# Altium project BaseNode.PrjPCB
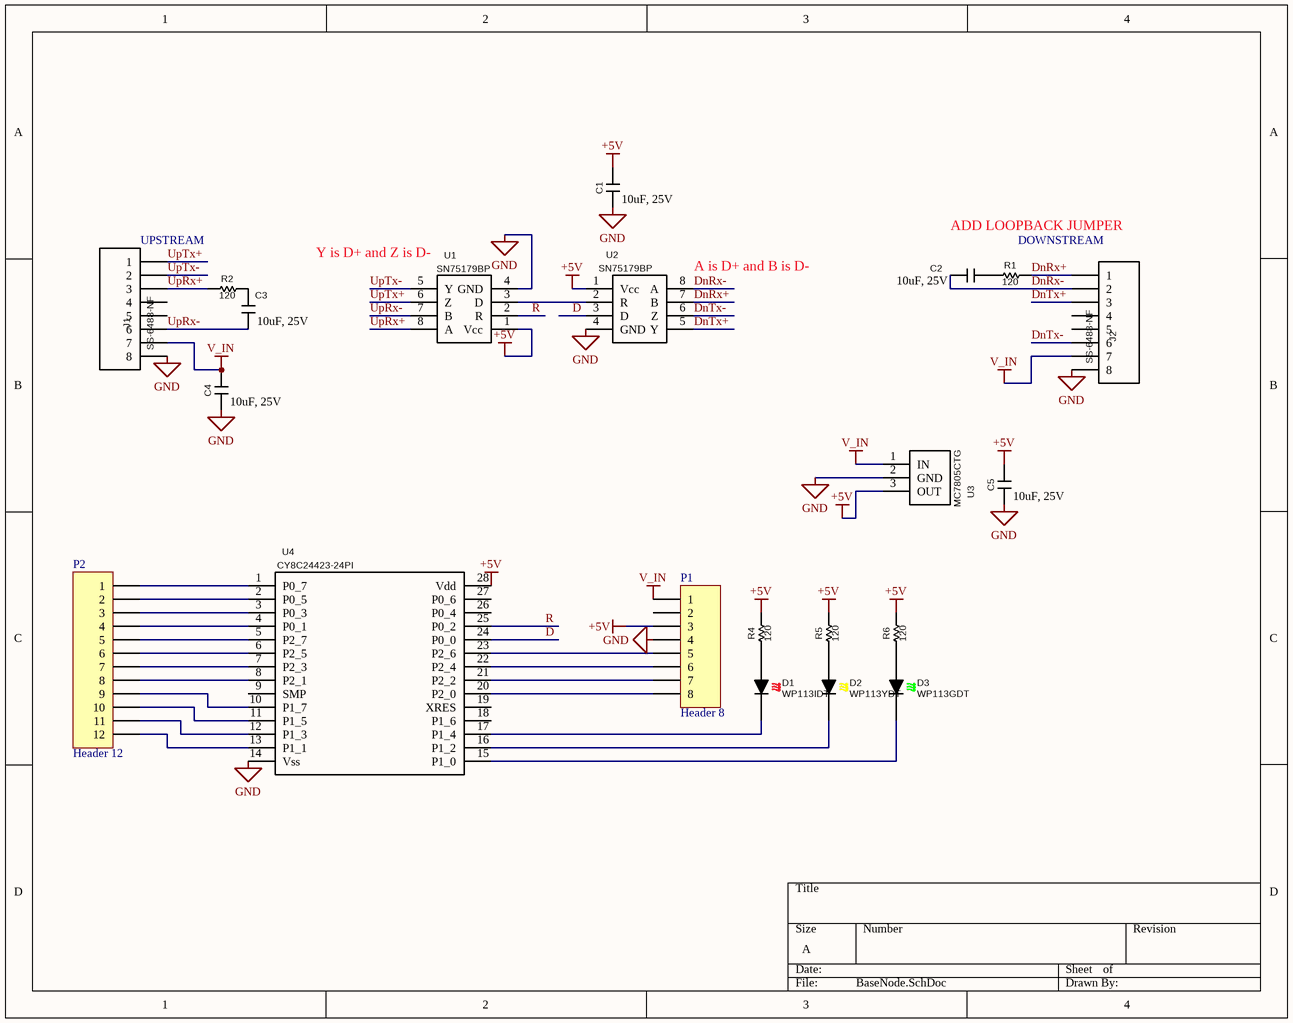
[diagram p0: BaseNode.SchDoc]
1 sheet, 21 parts. Net scope: global (net labels, ports and power ports of the same name join across sheets).
Board file: BaseNode.PcbDoc

## Sheet BaseNode.SchDoc
size A

### Parts
C1  10uF, 25V  [Capacitor TH 0.2]
C2  10uF, 25V  [Capacitor TH 0.2]
C3  10uF, 25V  [Capacitor TH 0.2]
C4  10uF, 25V  [Capacitor TH 0.2]
C5  10uF, 25V  [Capacitor TH 0.2]
D1  WP113IDT  [LED 100mil]
D2  WP113YDT  [LED 100mil]
D3  WP113GDT  [LED 100mil]
J1  SS-6488-NF  [SS-6488-NF]
J2  SS-6488-NF  [SS-6488-NF]
P1  Header 8  [HDR1X8]
P2  Header 12  [HDR1X12]
R1  120  [Resistor Axial 100mil]
R2  120  [Resistor Axial 100mil]
R4  120  [Resistor Axial 100mil]
R5  120  [Resistor Axial 100mil]
R6  120  [Resistor Axial 100mil]
U1  SN75179BP  [dip8]
U2  SN75179BP  [dip8]
U3  MC7805CTG  [TO-220]
U4  CY8C24423-24PI  [dip28]

### Nets
+5V: C1.2 C5.2 P1.3 R4.2 R5.2 R6.2 U1.1(Vcc) U2.1(Vcc) U3.3(OUT) U4.28(Vdd)
GND: C1.1 C4.1 C5.1 J1.8 J2.8 P1.4 U1.4(GND) U2.4(GND) U3.2(GND) U4.14(Vss)
V_IN: C4.2 J1.7 J2.7 P1.1 U3.1(IN)
D: U2.3(D) U4.24(P0_0)
DnRx+: J2.1 R1.2 U2.7(B)
DnRx-: C2.2 J2.2 U2.8(A)
DnTx+: J2.3 U2.5(Y)
DnTx-: J2.6 U2.6(Z)
R: U1.2(R) U4.25(P0_2)
UpRx+: J1.3 R2.1 U1.8(A)
UpRx-: C3.1 J1.6 U1.7(B)
UpTx+: J1.1 U1.6(Z)
UpTx-: J1.2 U1.5(Y)
NetC2_1: C2.1 R1.1
NetC3_2: C3.2 R2.2
NetD1_A: D1.A R4.1
NetD1_K: D1.K U4.17(P1_4)
NetD2_A: D2.A R5.1
NetD2_K: D2.K U4.16(P1_2)
NetD3_A: D3.A R6.1
NetD3_K: D3.K U4.15(P1_0)
NetP1_5: P1.5 U4.23(P2_6)
NetP1_6: P1.6 U4.22(P2_4)
NetP1_7: P1.7 U4.21(P2_2)
NetP1_8: P1.8 U4.20(P2_0)
NetP2_1: P2.1 U4.1(P0_7)
NetP2_2: P2.2 U4.2(P0_5)
NetP2_3: P2.3 U4.3(P0_3)
NetP2_4: P2.4 U4.4(P0_1)
NetP2_5: P2.5 U4.5(P2_7)
NetP2_6: P2.6 U4.6(P2_5)
NetP2_7: P2.7 U4.7(P2_3)
NetP2_8: P2.8 U4.8(P2_1)
NetP2_9: P2.9 U4.10(P1_7)
NetP2_10: P2.10 U4.11(P1_5)
NetP2_11: P2.11 U4.12(P1_3)
NetP2_12: P2.12 U4.13(P1_1)
NetU1_3: U1.3(D) U2.2(R)

Not connected (* = marked no-connect by the designer): J1 4 5; J2 4 5; P1 2; U4 9(SMP) 18(P1_6) 19(XRES) 26(P0_4) 27(P0_6)

### Notes on the sheet
- ADD LOOPBACK JUMPER
- (near J1) UPSTREAM
- (near U1) Y is D+ and Z is D-
- (near U2) A is D+ and B is D-
- DOWNSTREAM

### Library data of the parts
C1-C5 = Capacitor: Manufacturer: TDK Corporation; ManufacturerPN: FK20Y5V1E106Z; Vendor: Digi-Key; VendorPN: 445-2892-ND; ComponentLink1Description: Datasheet; ComponentLink1URL: http://www.tdk.co.jp/tefe02/e4941_fk.pdf; Value: 10uF, 25V
D1 = WP113IDT: LED RECT 2X5MM 625NM RED DIFF; Manufacturer: Kingbright Corp; Vendor: Digi-Key; VendorPN: 754-1201-ND; ComponentLink1URL: http://www.us.kingbright.com/images/catalog/SPEC/WP113GDT.pdf; ComponentLink1Description: Datasheet; ManufacturerPN: WP113IDT
D2 = WP113YDT: LED RECT 2X5MM 588NM YLW DIFF; Manufacturer: Kingbright Corp; Vendor: Digi-Key; VendorPN: 754-1203-ND; ComponentLink1URL: http://www.us.kingbright.com/images/catalog/SPEC/WP113YDT.pdf; ComponentLink1Description: Datasheet; ManufacturerPN: WP113YDT
D3 = WP113GDT: LED RECT 2X5MM 568NM GRN DIFF; Manufacturer: Kingbright Corp; Vendor: Digi-Key; VendorPN: 754-1200-ND; ComponentLink1URL: http://www.us.kingbright.com/images/catalog/SPEC/WP113GDT.pdf; ComponentLink1Description: Datasheet; ManufacturerPN: WP113GDT
J1 J2 = SS-6488-NF: CONN 8-8 MOD JACK; Manufacturer: Stewart Connector; Vendor: Digi-Key; VendorPN: 380-1022-ND; ManufacturerPN: SS-6488-NF; ComponentLink1Description: Datasheet; ComponentLink1URL: http://www.belfuse.com/Data/Datasheets/CT640041.pdf
P1 = Header 8: Header, 8-Pin; LatestRevisionDate: 17-Jul-2002; LatestRevisionNote: Re-released for DXP Platform.; Publisher: Altium Limited
P2 = Header 12: Header, 12-Pin; LatestRevisionDate: 17-Jul-2002; LatestRevisionNote: Re-released for DXP Platform.; Publisher: Altium Limited
R1 R2 R4-R6 = Resistor: Manufacturer: Stackpole Electronics Inc; ManufacturerPN: CF18JT120R; Vendor: Digi-Key; VendorPN: CF18JT120RCT-ND; Tolerance: 5%; ComponentLink1Description: Datasheet; ComponentLink1URL: http://www.seielect.com/catalog/SEI-CF_CFM.pdf; Power: *; Value: 120; Package: 0402
U1 U2 = SN75179BP: IC DIFF DRIVER/RECPAIR 8-DIP; Manufacturer: Texas Instruments; Vendor: Digi-Key; VendorPN: 296-6861-5-ND; ManufacturerPN: SN75179BP; ComponentLink1Description: Datasheet; ComponentLink1URL: http://www.ti.com/lit/ds/symlink/sn75179b.pdf
U3 = MC7805CTG: IC REG VOLT POS 1A 5V TO220AB; Manufacturer: ON Semiconductor; Vendor: Digi-Key; VendorPN: MC7805CTGOS-ND; ManufacturerPN: MC7805CTG; ComponentLink1Description: Datasheet; ComponentLink1URL: http://www.onsemi.com/pub_link/Collateral/MC7800-D.PDF
U4 = CY8C24423-24PI: IC MCU 4K FLASH 256B 28-DIP; Manufacturer: Cypress Semiconductor Corp; Vendor: Digi-Key; VendorPN: 428-1556-5-ND; ManufacturerPN: CY8C24423-24PI; ComponentLink1Description: Datasheet; ComponentLink1URL: http://media.digikey.com/pdf/Data%20Sheets/Cypress%20PDFs/CY8C24123,223,423.pdf